# EAGLE design stm32breakout (EAGLE 9.3.0)
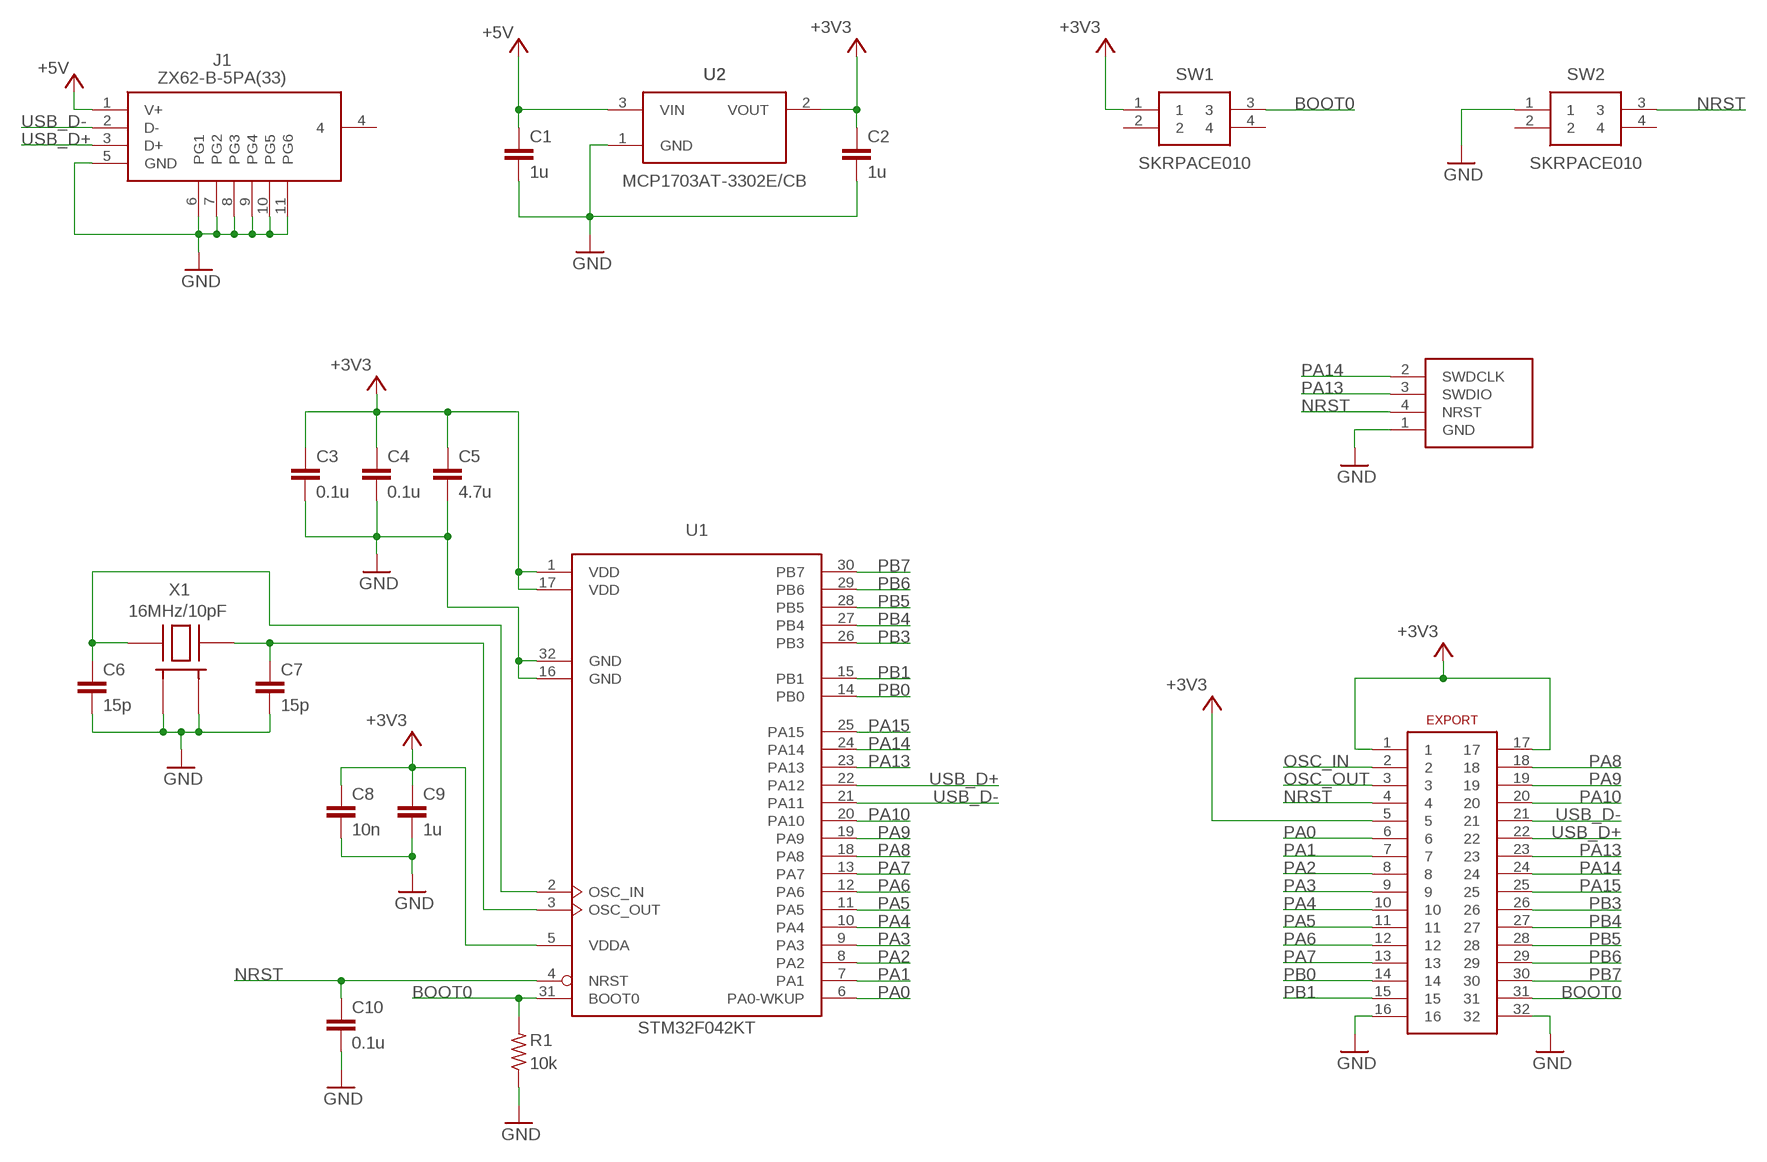
[diagram p0: schematic, sheet 1]

## Parts
C1  1u  RCL_C-EUC0402-HS  [RCL_C0402_HS]
C2  1u  RCL_C-EUC0402-HS  [RCL_C0402_HS]
C3  0.1u  RCL_C-EUC0402-HS  [RCL_C0402_HS]
C4  0.1u  RCL_C-EUC0402-HS  [RCL_C0402_HS]
C5  4.7u  RCL_C-EUC0402-HS  [RCL_C0402_HS]
C6  15p  RCL_C-EUC0402-HS  [RCL_C0402_HS]
C7  15p  RCL_C-EUC0402-HS  [RCL_C0402_HS]
C8  10n  RCL_C-EUC0402-HS  [RCL_C0402_HS]
C9  1u  RCL_C-EUC0402-HS  [RCL_C0402_HS]
C10  0.1u  RCL_C-EUC0402-HS  [RCL_C0402_HS]
EXPORT  2X16PIN  [2X16PIN]
J1  ZX62-B-5PA(33)  ZX62-B-5PA(33)-FULL  [ZX62-B-5PA(33)-TRUE-HANDSOLD]
R1  10k  RCL_R-US_R0402-HS  [RCL_R0402_HS]
SW1  SKRPACE010  [SMT(4.2X3.2)]
SW2  SKRPACE010  [SMT(4.2X3.2)]
U1  STM32F042KT  [LQFP32-M]
U2  MCP1703AT-3302E/CB  LDO-REGULATOR  [SOT23]
U$1  4PIN-DEBUG  [4PIN-DEBUG]
X1  16MHz/10pF  CRYSTAL3225HS  [CRYSTAL3225-HS]

## Nets
+3V3 [pwr]: C2.1 C3.1 C4.1 C5.1 C8.1 C9.1 EXPORT.1 EXPORT.5 EXPORT.17 SW1.1 U1.1(VDD) U1.5(VDDA) U1.17(VDD) U2.2(VOUT)
+5V [pwr]: C1.1 J1.1(V+) U2.3(VIN)
BOOT0: EXPORT.31 R1.2 SW1.3 U1.31(BOOT0)
GND [gnd]: C1.2 C2.2 C3.2 C4.2 C5.2 C6.2 C7.2 C8.2 C9.2 C10.2 EXPORT.16 EXPORT.32 J1.5(GND) J1.6(PG1) J1.7(PG2) J1.8(PG3) J1.9(PG4) J1.10(PG5) J1.11(PG6) R1.1 SW2.1 U1.16(GND) U1.32(GND) U2.1(GND) U$1.1(GND) X1.2(GND_1) X1.4(GND_2)
NRST: C10.1 EXPORT.4 SW2.3 U1.4(NRST) U$1.4(NRST)
OSC_IN: C6.1 EXPORT.2 U1.2(OSC_IN) X1.1(HOT_1)
OSC_OUT: C7.1 EXPORT.3 U1.3(OSC_OUT) X1.3(HOT_2)
PA0: EXPORT.6 U1.6(PA0-WKUP)
PA1: EXPORT.7 U1.7(PA1)
PA2: EXPORT.8 U1.8(PA2)
PA3: EXPORT.9 U1.9(PA3)
PA4: EXPORT.10 U1.10(PA4)
PA5: EXPORT.11 U1.11(PA5)
PA6: EXPORT.12 U1.12(PA6)
PA7: EXPORT.13 U1.13(PA7)
PA8: EXPORT.18 U1.18(PA8)
PA9: EXPORT.19 U1.19(PA9)
PA10: EXPORT.20 U1.20(PA10)
PA13: EXPORT.23 U1.23(PA13) U$1.3(SWDIO)
PA14: EXPORT.24 U1.24(PA14) U$1.2(SWDCLK)
PA15: EXPORT.25 U1.25(PA15)
PB0: EXPORT.14 U1.14(PB0)
PB1: EXPORT.15 U1.15(PB1)
PB3: EXPORT.26 U1.26(PB3)
PB4: EXPORT.27 U1.27(PB4)
PB5: EXPORT.28 U1.28(PB5)
PB6: EXPORT.29 U1.29(PB6)
PB7: EXPORT.30 U1.30(PB7)
USB_D+: EXPORT.22 J1.3(D+) U1.22(PA12)
USB_D-: EXPORT.21 J1.2(D-) U1.21(PA11)
Unconnected: J1.4 SW1.2 SW1.4 SW2.2 SW2.4

## Library data of the parts
C1-C10 = gen-discrete3:RCL_C-EU: CAPACITOR, European symbol
EXPORT = breakout:2X16PIN
J1 = ZX62-B-5PA(33):ZX62-B-5PA(33)-FULL
R1 = gen-discrete3:RCL_R-US_: RESISTOR, American symbol
SW1 SW2 = SKRPACE010:SKRPACE010: Tactile Switches 4.2x3.2x2.5mm 260gf Source: Datasheet <http://www.alps.com/prod/info/E/HTML/Tact/SurfaceMount/SKRP/SKRPACE010.html>; ARROW_PART_NUMBER: SKRPACE010; DESCRIPTION: Tactile Switches 4.2x3.2x2.5mm 260gf; HEIGHT: mm; MANUFACTURER_NAME: ALPS; MANUFACTURER_PART_NUMBER: SKRPACE010
U1 = stm32:STM32F042K*T
U2 = SOT23_Module:LDO-REGULATOR
U$1 = breakout:4PIN-DEBUG
X1 = CRYSTAL3225:CRYSTAL3225: Crystals 3225

## Net classes
1 gnd: width 0.2 mm
2 pwr: width 0.2 mm

## Board
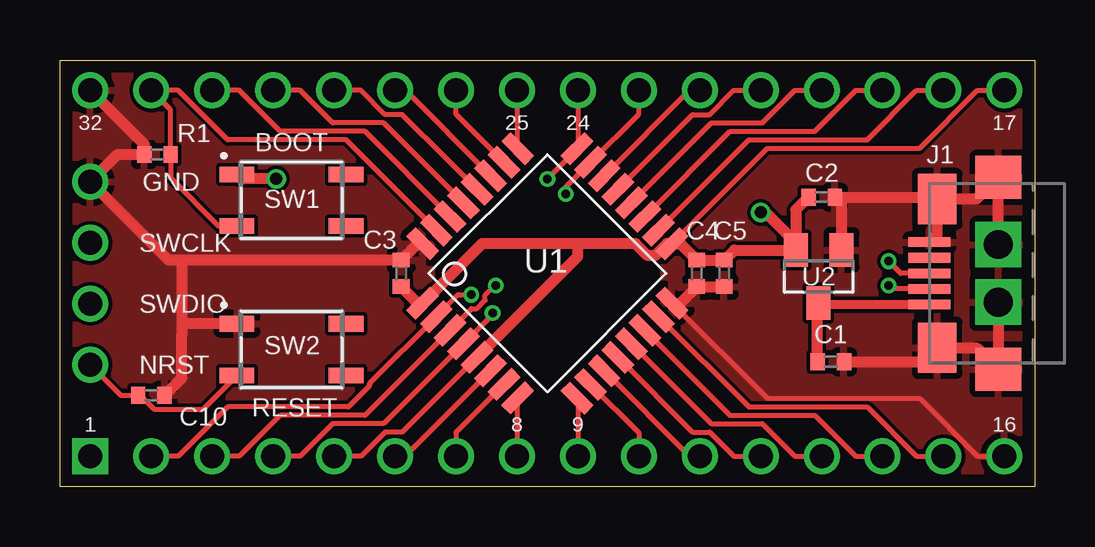
[diagram p1: board, top side]
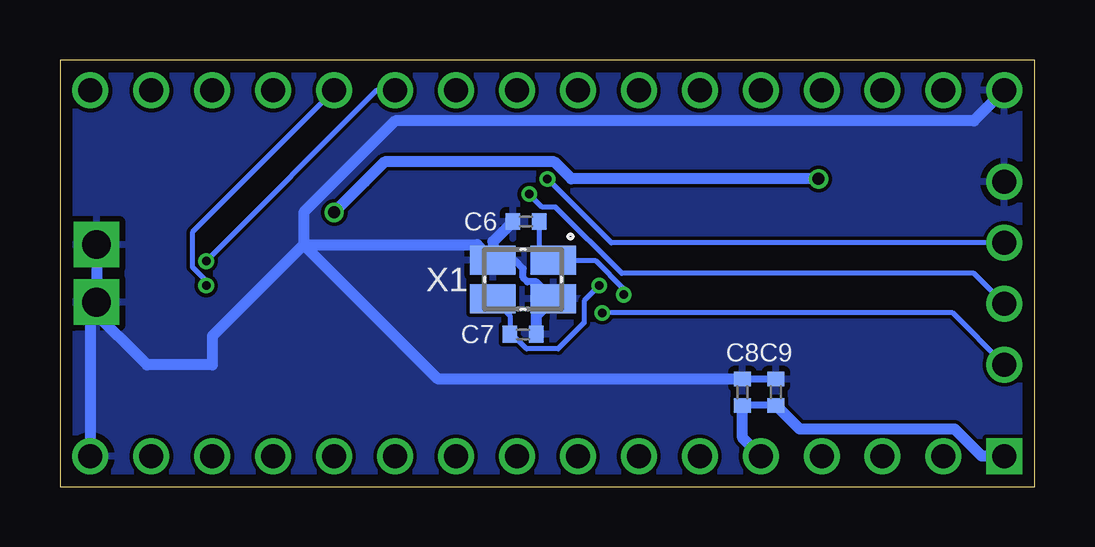
[diagram p2: board, bottom side, seen from below]

Size 40.64 x 17.78 mm. Coordinates in mm from the lower left corner, seen from the top.
Copper layers (1*16): Top 0.035mm / dielectric 1.6mm / Bottom 0.035mm
Design rules "Elecrow_2-layer_PCB_eagle_rule": minimum track width 6mil, minimum drill 12mil, track to track 6mil, track to pad 6mil, pad to pad 6mil, via to via 8mil, smd to smd 0mil, copper to edge 20mil, drill to drill 10mil, minimum pad ring 6mil, minimum via ring 6mil, stop-mask expansion 0mil, vias tented up to drill 100mil, thermal gap 10mil

### Footprints (pad centres in the part's own frame; a part is rotated, then mirrored left to right if it is on the bottom)
RCL_C0402_HS = smd 0.6 x 0.7: 1 -0.55,0; 2 0.55,0
2X16PIN = drill 1 square: 1 -19.05,-7.62 | drill 1: 2 -16.51,-7.62; 3 -13.97,-7.62; 4 -11.43,-7.62; 5 -8.89,-7.62; 6 -6.35,-7.62; 7 -3.81,-7.62; 8 -1.27,-7.62; 9 1.27,-7.62; 10 3.81,-7.62; 11 6.35,-7.62; 12 8.89,-7.62; 13 11.43,-7.62; 14 13.97,-7.62; 15 16.51,-7.62; 16 19.05,-7.62; 17 19.05,7.62; 18 16.51,7.62; 19 13.97,7.62; 20 11.43,7.62; 21 8.89,7.62; 22 6.35,7.62; 23 3.81,7.62; 24 1.27,7.62; 25 -1.27,7.62; 26 -3.81,7.62; 27 -6.35,7.62; 28 -8.89,7.62; 29 -11.43,7.62; 30 -13.97,7.62; 31 -16.51,7.62; 32 -19.05,7.62
ZX62-B-5PA(33)-TRUE-HANDSOLD = smd 0.4 x 1.75: 1 -1.3,2.875; 2 -0.65,2.875; 3 0,2.875; 4 0.65,2.875; 5 1.3,2.875 | smd 2.1 x 1.6: 6 -3.1,2.55; 7 3.1,2.55 | drill 1.2 pad 1.9 square: 8 -1.2,0; 9 1.2,0 | smd 1.8 x 1.9: 10 -4,0; 11 4,0
RCL_R0402_HS = smd 0.6 x 0.7: 1 -0.55,0; 2 0.55,0
SMT(4.2X3.2) = smd 1.45 x 0.65: 1 -2.275,1.075; 2 2.275,1.075; 3 -2.275,-1.075; 4 2.275,-1.075
LQFP32-M = smd 0.54 x 1.4: 1 -2.8,-4.55; 2 -2,-4.55; 3 -1.2,-4.55; 4 -0.4,-4.55; 5 0.4,-4.55; 6 1.19,-4.55; 7 1.99,-4.55; 8 2.79,-4.55; 17 2.8,4.55; 18 2,4.55; 19 1.2,4.55; 20 0.4,4.55; 21 -0.4,4.55; 22 -1.2,4.55; 23 -2,4.55; 24 -2.8,4.55 | smd 1.4 x 0.54: 9 4.55,-2.8; 10 4.55,-2; 11 4.55,-1.2; 12 4.55,-0.4; 13 4.55,0.4; 14 4.55,1.2; 15 4.55,2; 16 4.55,2.8; 25 -4.55,2.8; 26 -4.55,2; 27 -4.55,1.2; 28 -4.55,0.4; 29 -4.55,-0.4; 30 -4.55,-1.2; 31 -4.55,-2; 32 -4.55,-2.8
SOT23 = smd 1 x 1.4: 1 -0.95,-1.1; 2 0.95,-1.1; 3 0,1.1
4PIN-DEBUG = drill 1: 1 3.81,0; 2 1.27,0; 3 -1.27,0; 4 -3.81,0
CRYSTAL3225-HS = smd 1.9 x 1.2: 1 -1.26,-0.8; 2 1.26,-0.8; 3 1.26,0.8; 4 -1.26,0.8

### Placement (x,y rotation side)
C1  32.13,5.21 0 top
C2  31.75,12.06 0 top
C3  14.22,8.89 90 top
C4  26.54,8.89 270 top
C5  27.69,8.89 270 top
C6  21.21,11.05 180 bottom
C7  21.34,6.35 0 bottom
C8  12.19,3.94 90 bottom
C9  10.79,3.94 90 bottom
C10  3.81,3.81 0 top
EXPORT  20.32,8.89 0 top
J1  39.12,8.89 90 top
R1  4.06,13.84 0 top
SW1  9.65,11.94 0 top
SW2  9.65,5.71 0 top
U1  20.32,8.89 315 top
U2  31.62,8.76 180 top
U$1  1.27,8.89 90 top
X1  21.34,8.64 180 bottom

### Tracks (layer width: path | path; a pad name or v marks a point on that pad's centre or on a via)
+3V3  (via drill 0.5)
  Top 0.2: U1.5 14.27,2.27 13.55,2.27 12.55,1.27 EXPORT.5 | U1.17 29.49,14.1 35.84,14.1 38.25,16.51 EXPORT.17
  Top 0.45: 21.59,10.13 23.99,10.13 24.49,9.63 24.8,9.63 25.3,10.13 U1.17 25.86,10.13 C4.1 C5.1 28.11,9.86 U2.2 30.67,10.16 | 21.59,10.13 17.6,10.13 U1.1 14.91,7.65 C3.1 | U1.5 21.59,9.59 21.59,10.13 | C2.1 30.67,11.54 30.67,10.16 | v29.21,11.43 29.4,11.43 30.67,10.16 | v9.02,12.83 7.56,12.83 SW1.1
  Bottom 0.3: C9.1 C8.1
  Bottom 0.45: EXPORT.1 2.22,1.27 3.34,2.4 9.8,2.4 C9.1 | EXPORT.5 12.19,2.03 C8.1 | 27.11,13.53 27.94,12.7 | 27.94,12.7 v29.21,11.43 | v9.02,12.83 19.32,12.83 20.03,13.53 27.11,13.53 | 27.11,13.53 27.94,12.7
+5V
  Top 0.38: J1.1 31.7,7.59 U2.3
  Top 0.45: C1.1 31.58,7.47 31.7,7.59
BOOT0
  Top 0.2: U1.31 11.93,14.45 6.99,14.45 4.93,16.51 EXPORT.31 4.61,15.71 R1.2 4.61,12.86 6.62,10.86 SW1.3
GND
  Top 0.2: U1.16 29.49,3.68 35.84,3.68 38.25,1.27 EXPORT.16
  Top 0.45: J1.9 J1.11 38.22,11.99 36.83,11.99 | J1.8 J1.10 38.22,5.79 36.83,5.79 | 36.83,11.99 J1.7 36.57,10.52 J1.5 | J1.6 36.83,5.79 | U1.16 25.86,7.65 C4.2 C5.2 | U1.32 14.91,10.13 C3.2 5.08,9.44 | EXPORT.32 3.51,14.27 R1.1 2.41,13.84 U$1.1 4.53,9.44 5.08,9.44 | 36.83,11.99 36.76,12.06 C2.2 32.57,11.79 U2.1 | C1.2 36.25,5.21 36.83,5.79 | C10.2 5.08,4.53 5.08,6.35 5.08,6.73 | 5.08,9.44 5.08,6.73 | SW2.1 5.14,6.79 5.08,6.73
  Bottom 0.3: X1.2 21.68,9.44 21.33,9.09 21.33,8.71 21.15,8.53 20.77,8.53 X1.4 | C9.2 C8.2
  Bottom 0.45: J1.9 J1.8 39.37,7.44 | 30.48,10.09 23.25,10.09 X1.2 22.6,10.21 C6.2 | 39.37,7.44 EXPORT.16 | X1.4 20.79,7.13 C7.2 | C8.2 24.88,4.49 30.48,10.09 | 30.48,10.09 34.29,6.28 34.29,5.08 37.01,5.08 39.37,7.44 | EXPORT.32 2.54,15.24 26.67,15.24 30.48,11.43 30.48,10.09
  pour Bottom: 0,17.78 40.64,17.78 40.64,0 0,0
  pour Top: -1.27,17.78 15.49,17.78 15.49,0 -1.27,0
  pour Top: 41.91,17.78 25.15,17.78 25.15,0 41.91,0
NRST  (via drill 0.35)
  Top 0.2: v18.03,7.24 18.03,7.17 U1.4 13.49,2.62 11.37,2.62 10.01,1.27 EXPORT.4 | U$1.4 2.54,3.81 C10.1 3.35,3.81 3.96,3.21 5.95,3.21 SW2.3
  Bottom 0.2: U$1.4 3.43,7.24 v18.03,7.24
OSC_IN  (via drill 0.35)
  Top 0.2: v17.14,8 16.6,8 U1.2 12.9,4.3 12.9,4.21 12.02,3.33 6.99,3.33 4.93,1.27 EXPORT.2
  Bottom 0.2: C6.1 20.66,10.02 X1.1 18.33,9.44 17.14,8.26 v17.14,8
OSC_OUT  (via drill 0.35)
  Top 0.2: v18.16,8.38 18.11,8.38 17.73,7.99 17.73,7.76 17.39,7.42 17.15,7.42 U1.3 12.71,2.98 9.18,2.98 7.47,1.27 EXPORT.3
  Bottom 0.2: X1.3 21.89,7.13 C7.1 21.79,6.35 21.19,5.75 19.88,5.75 18.8,6.83 18.8,7.75 v18.16,8.38
PA0
  Top 0.2: U1.6 14.38,1.27 EXPORT.6
PA1
  Top 0.2: U1.7 16.51,2.27 EXPORT.7
PA2
  Top 0.2: U1.8 19.05,3.67 EXPORT.8
PA3
  Top 0.2: U1.9 21.59,3.66 EXPORT.9
PA4
  Top 0.2: U1.10 24.13,2.25 EXPORT.10
PA5
  Top 0.2: U1.11 26.24,1.27 EXPORT.11
PA6
  Top 0.2: U1.12 26.37,2.27 27.09,2.27 28.09,1.27 EXPORT.12
PA7
  Top 0.2: U1.13 27.15,2.62 29.27,2.62 30.63,1.27 EXPORT.13
PA8
  Top 0.2: U1.18 28.71,14.45 33.65,14.45 35.71,16.51 EXPORT.18
PA9
  Top 0.2: U1.19 27.93,14.8 31.46,14.8 33.17,16.51 EXPORT.19
PA10
  Top 0.2: U1.20 27.15,15.15 29.27,15.15 30.63,16.51 EXPORT.20
PA13  (via drill 0.35)
  Top 0.2: EXPORT.23 24.13,15.53 U1.23 21.08,12.48 v21.08,12.19
  Bottom 0.2: v21.08,12.19 20.54,11.65 19.98,11.65 17.21,8.89 2.54,8.89 U$1.3
PA14  (via drill 0.35)
  Top 0.152: 21.59,14.12 U1.24
  Top 0.2: EXPORT.24 21.59,14.12 21.59,14.1 v20.32,12.83
  Bottom 0.2: U$1.2 17.65,10.16 v20.32,12.83
PA15
  Top 0.152: 19.05,14.12 U1.25
  Top 0.2: EXPORT.25 19.05,14.12
PB0
  Top 0.2: U1.14 27.93,2.98 31.46,2.98 33.17,1.27 EXPORT.14
PB1
  Top 0.2: U1.15 28.71,3.33 33.65,3.33 35.71,1.27 EXPORT.15
PB3
  Top 0.2: U1.26 16.51,15.53 EXPORT.26
PB4
  Top 0.2: U1.27 14.4,16.51 EXPORT.27
PB5
  Top 0.2: U1.28 16.16,13.62 14.27,15.51 13.55,15.51 12.55,16.51 EXPORT.28
PB6
  Top 0.2: U1.29 13.49,15.15 11.37,15.15 10.01,16.51 EXPORT.29
PB7
  Top 0.2: U1.30 12.71,14.8 9.18,14.8 7.47,16.51 EXPORT.30
USB_D+  (via drill 0.35)
  Top 0.2: U1.22 26.24,16.51 EXPORT.22 | J1.3 35.05,8.89 v34.54,9.4
  Bottom 0.2: EXPORT.22 27.43,16.51 v34.54,9.4
USB_D-  (via drill 0.35)
  Top 0.2: U1.21 26.37,15.51 27.09,15.51 28.09,16.51 EXPORT.21 | J1.2 34.69,8.24 v34.54,8.38
  Bottom 0.2: v34.54,8.38 34.54,8.58 35.12,9.16 35.12,10.6 EXPORT.21

### Text on the board
tPlace: BOOT | GND | SWCLK | SWDIO | NRST | RESET